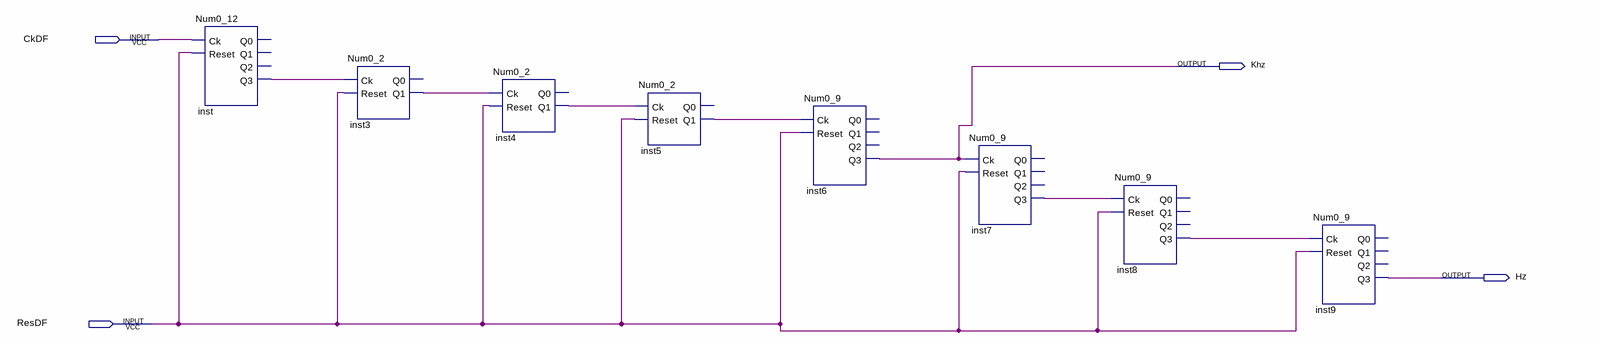
[diagram p0: schematic sheet]
// Quartus schematic BlocDivFrecvfaraNOT.bdf as structural Verilog: 8 symbols, 4 pins
module BlocDivFrecvfaraNOT (
  input  CkDF,
  input  ResDF,
  output Khz,
  output Hz
);

  wire inst3_q1, inst4_q1, inst5_q1, inst7_q3, inst8_q3, inst_q3;

  Num0_12 inst (.Ck(CkDF), .Reset(ResDF), .Q3(inst_q3));  // open: Q0, Q1, Q2
  Num0_2 inst3 (.Ck(inst_q3), .Reset(ResDF), .Q1(inst3_q1));  // open: Q0
  Num0_2 inst4 (.Ck(inst3_q1), .Reset(ResDF), .Q1(inst4_q1));  // open: Q0
  Num0_2 inst5 (.Ck(inst4_q1), .Reset(ResDF), .Q1(inst5_q1));  // open: Q0
  Num0_9 inst6 (.Ck(inst5_q1), .Reset(ResDF), .Q3(Khz));  // open: Q0, Q1, Q2
  Num0_9 inst7 (.Ck(Khz), .Reset(ResDF), .Q3(inst7_q3));  // open: Q0, Q1, Q2
  Num0_9 inst8 (.Ck(inst7_q3), .Reset(ResDF), .Q3(inst8_q3));  // open: Q0, Q1, Q2
  Num0_9 inst9 (.Ck(inst8_q3), .Reset(ResDF), .Q3(Hz));  // open: Q0, Q1, Q2
endmodule
